# EAGLE design 3x3Bottom (EAGLE 7.3.0)
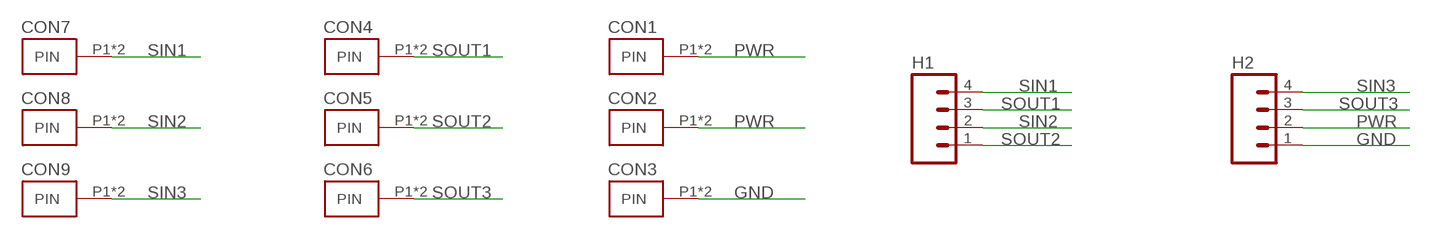
[diagram p0: schematic, sheet 1]

## Parts
CON1  SHIELD_FINGER0820  [SHIELD_FINGER_PKG]
CON2  SHIELD_FINGER0820  [SHIELD_FINGER_PKG]
CON3  SHIELD_FINGER0820  [SHIELD_FINGER_PKG]
CON4  SHIELD_FINGER0820  [SHIELD_FINGER_PKG]
CON5  SHIELD_FINGER0820  [SHIELD_FINGER_PKG]
CON6  SHIELD_FINGER0820  [SHIELD_FINGER_PKG]
CON7  SHIELD_FINGER0820  [SHIELD_FINGER_PKG]
CON8  SHIELD_FINGER0820  [SHIELD_FINGER_PKG]
CON9  SHIELD_FINGER0820  [SHIELD_FINGER_PKG]
H1  M04  [1X04_NO_HOLES]
H2  M04  [1X04_NO_HOLES]

## Nets
GND: CON3.P1(PIN) CON3.P2(PIN) H2.1
PWR: CON1.P1(PIN) CON1.P2(PIN) CON2.P1(PIN) CON2.P2(PIN) H2.2
SIN1: CON7.P1(PIN) CON7.P2(PIN) H1.4
SIN2: CON8.P1(PIN) CON8.P2(PIN) H1.2
SIN3: CON9.P1(PIN) CON9.P2(PIN) H2.4
SOUT1: CON4.P1(PIN) CON4.P2(PIN) H1.3
SOUT2: CON5.P1(PIN) CON5.P2(PIN) H1.1
SOUT3: CON6.P1(PIN) CON6.P2(PIN) H2.3

## Library data of the parts
CON1-CON9 = MakerShoe:SHIELD_FINGER
H1 H2 = SparkFun-Connectors:M04: Header 4 Standard 4-pin 0.1" header. Use with straight break away headers (SKU : PRT-00116), right angle break away headers (PRT-00553), swiss pins (PRT-00743), machine pins (PRT-00117), and female headers (PRT-00115). Molex polarized connector foot print use with SKU : PRT-08231 with associated crimp pins and housings. 1MM SMD Version SKU: PRT-10208

## Board
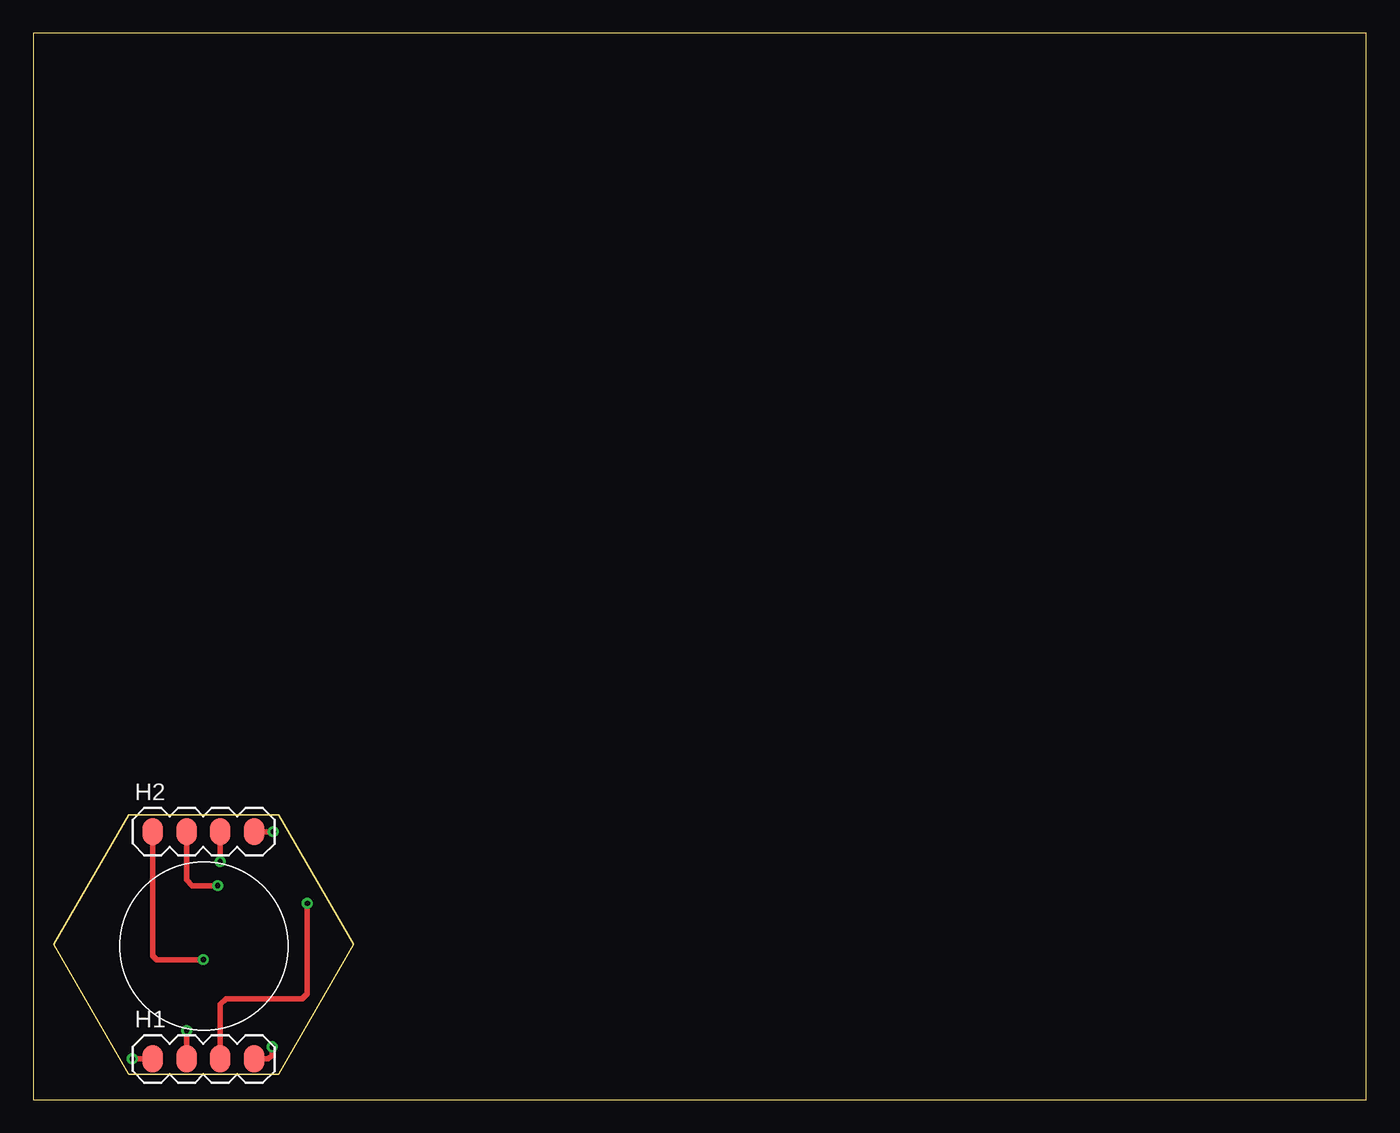
[diagram p1: board, top side]
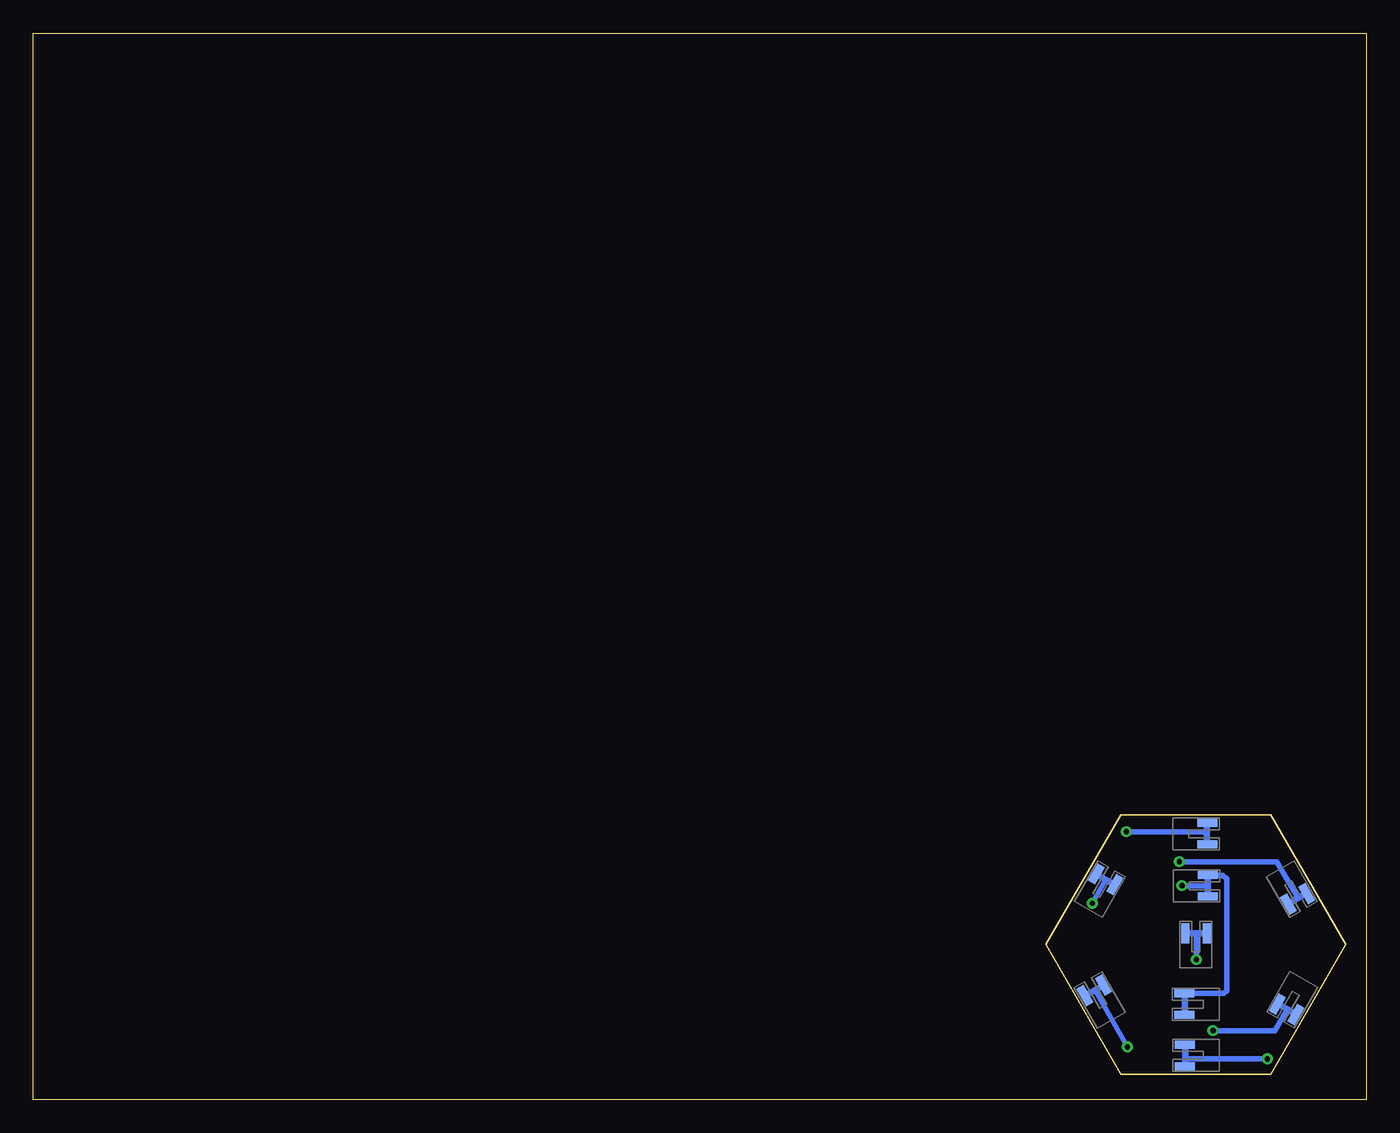
[diagram p2: board, bottom side, seen from below]

Size 100 x 80 mm. Coordinates in mm from the lower left corner, seen from the top.
Outline: 0,0 100,0 100,80 0,80 0,0
Outline: 1.52,11.62 7.15,21.37 18.4,21.37 24.02,11.62 18.4,1.88 7.15,1.88 1.52,11.62
Copper layers (1*16): Top 0.035mm / dielectric 1.5mm / Bottom 0.035mm
Design rules "default": minimum track width 10mil, minimum drill 24mil, track to track 8mil, track to pad 8mil, pad to pad 8mil, via to via 8mil, smd to smd 8mil, copper to edge 40mil, drill to drill 8mil, minimum pad ring 10mil, minimum via ring 8mil, stop-mask expansion 4mil, vias tented up to drill 0mil, thermal gap 10mil

### Footprints (pad centres in the part's own frame; a part is rotated, then mirrored left to right if it is on the bottom)
SHIELD_FINGER_PKG = smd 1.5 x 0.6 bottom: P1 0.025,0.787; P2 0.025,-0.813
1X04_NO_HOLES = smd 1.524 x 2.032: 1 0,0; 2 2.54,0; 3 5.08,0; 4 7.62,0

### Placement (x,y rotation side)
CON1  13.6,7.17 0 top
CON2  11.9,16.02 180 top
CON3  12.75,12.45 90 top
CON4  19.55,16.5 120 top
CON5  13.57,3.33 0 top
CON6  5.17,15.07 240 top
CON7  20.4,8.18 60 top
CON8  5.97,6.8 300 top
CON9  11.95,19.93 180 top
H1  8.95,3.05 0 top
H2  8.95,20.1 0 top

### Tracks (layer width: path | path; a pad name or v marks a point on that pad's centre or on a via)
GND  (via drill 0.4)
  Top 0.4: H2.1 8.95,10.8 9.25,10.5 v12.75,10.5
  Bottom 0.4: v12.75,10.5 12.75,12.47 | 12.75,12.47 CON3.P1 | CON3.P1 | CON3.P2 12.75,12.47 | 12.75,12.47
PWR  (via drill 0.4)
  Top 0.4: H2.2 11.49,16.48 11.93,16.05 v13.82,16.05
  Bottom 0.4: CON2.P2 11.86,16.82 10.75,16.82 10.47,16.55 10.47,8.18 10.69,7.96 CON1.P1 CON1.P2 | v13.82,16.05 11.93,16.05 11.9,16.07 11.9,16.81 CON2.P2 | CON2.P2 CON2.P1
SIN1  (via drill 0.4)
  Top 0.4: H1.4 17.62,3.05 17.9,3.33 17.9,3.92 v17.93,3.95
  Bottom 0.4: v17.93,3.95 20.35,8.22 CON7.P1 CON7.P2
SIN2  (via drill 0.4)
  Top 0.4: H1.2 v11.49,5.17 v11.5,5.17
  Bottom 0.4: v11.5,5.17 6.88,5.17 5.92,6.78 | 5.92,6.78 CON8.P2 | 5.92,6.78 CON8.P1
SIN3  (via drill 0.4)
  Top 0.4: H2.4 v18,20.1
  Bottom 0.4: v18,20.1 11.93,20.1 | 11.93,20.1 CON9.P2 | 11.93,20.1 CON9.P1 | CON9.P1
SOUT1  (via drill 0.4)
  Top 0.4: H1.3 14.03,7.13 14.45,7.55 20.18,7.55 20.55,7.92 v20.55,14.72
  Bottom 0.4: v20.55,14.72 19.52,16.52 | 19.52,16.52 CON4.P1 | 19.52,16.52 CON4.P2
SOUT2  (via drill 0.4)
  Top 0.4: H1.1 v7.42,3.05
  Bottom 0.4: v7.42,3.05 13.6,3.05 | 13.6,3.05 CON5.P2 | 13.6,3.05 CON5.P1 | CON5.P1
SOUT3  (via drill 0.4)
  Top 0.4: H2.3 v14.03,17.86 v14.03,17.85
  Bottom 0.4: v14.03,17.85 6.7,17.85 5.1,15.1 | 5.1,15.1 CON6.P2 | 5.1,15.1 CON6.P1